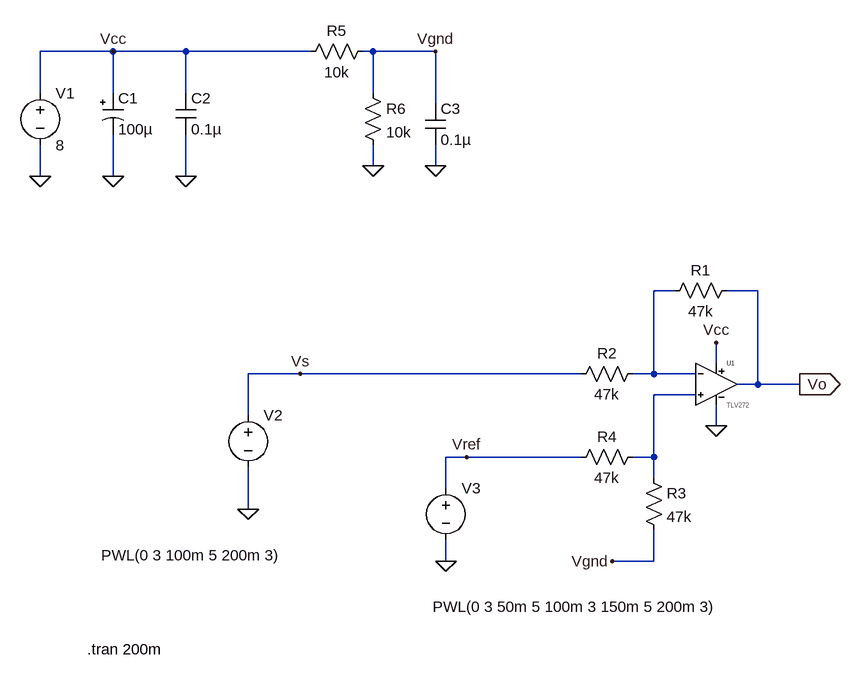
[diagram p0: schematic Virtual_Ground_Test_Circuit.asc]
Virtual_Ground_Test_Circuit.asc, the LTspice schematic file:
Version 4
SHEET 1 1016 728
WIRE -128 -208 -240 -208
WIRE -16 -208 -128 -208
WIRE 176 -208 -16 -208
WIRE 272 -208 256 -208
WIRE 368 -208 272 -208
WIRE -240 -144 -240 -208
WIRE -128 -144 -128 -208
WIRE -16 -144 -16 -208
WIRE 272 -144 272 -208
WIRE 368 -128 368 -208
WIRE 272 -32 272 -64
WIRE 368 -32 368 -64
WIRE -240 -16 -240 -64
WIRE -128 -16 -128 -80
WIRE -16 -16 -16 -80
WIRE 736 160 704 160
WIRE 864 160 816 160
WIRE 800 272 800 240
WIRE 160 288 80 288
WIRE 592 288 160 288
WIRE 704 288 704 160
WIRE 704 288 672 288
WIRE 768 288 704 288
WIRE 864 304 864 160
WIRE 864 304 832 304
WIRE 928 304 864 304
WIRE 768 320 704 320
WIRE 80 352 80 288
WIRE 800 368 800 336
WIRE 416 416 384 416
WIRE 592 416 416 416
WIRE 704 416 704 320
WIRE 704 416 672 416
WIRE 704 448 704 416
WIRE 384 464 384 416
WIRE 80 496 80 432
WIRE 384 576 384 544
WIRE 704 576 704 528
WIRE 704 576 640 576
FLAG -240 -16 0
FLAG -128 -16 0
FLAG -16 -16 0
FLAG 80 496 0
FLAG 800 240 Vcc
FLAG 800 368 0
FLAG 384 576 0
FLAG 928 304 Vo
IOPIN 928 304 Out
FLAG 416 416 Vref
FLAG 160 288 Vs
FLAG 272 -32 0
FLAG 368 -32 0
FLAG -128 -208 Vcc
FLAG 368 -208 Vgnd
FLAG 640 576 Vgnd
SYMBOL voltage -240 -160 R0
SYMATTR InstName V1
SYMATTR Value 8
SYMBOL polcap -144 -144 R0
SYMATTR InstName C1
SYMATTR Value 100µ
SYMBOL cap -32 -144 R0
SYMATTR InstName C2
SYMATTR Value 0.1µ
SYMBOL voltage 80 336 R0
WINDOW 3 -226 231 Left 2
WINDOW 123 0 0 Left 0
WINDOW 39 0 0 Left 0
SYMATTR Value PWL(0 3 100m 5 200m 3)
SYMATTR InstName V2
SYMBOL res 688 272 R90
WINDOW 0 0 56 VBottom 2
WINDOW 3 32 56 VTop 2
SYMATTR InstName R2
SYMATTR Value 47k
SYMBOL TLV272 800 304 R0
SYMATTR InstName U1
SYMBOL res 832 144 R90
WINDOW 0 0 56 VBottom 2
WINDOW 3 32 56 VTop 2
SYMATTR InstName R1
SYMATTR Value 47k
SYMBOL res 688 400 R90
WINDOW 0 0 56 VBottom 2
WINDOW 3 32 56 VTop 2
SYMATTR InstName R4
SYMATTR Value 47k
SYMBOL res 688 432 R0
SYMATTR InstName R3
SYMATTR Value 47k
SYMBOL voltage 384 448 R0
WINDOW 3 -20 198 Left 2
WINDOW 123 0 0 Left 0
WINDOW 39 0 0 Left 0
SYMATTR Value PWL(0 3 50m 5 100m 3 150m 5 200m 3)
SYMATTR InstName V3
SYMBOL res 272 -224 R90
WINDOW 0 0 56 VBottom 2
WINDOW 3 32 56 VTop 2
SYMATTR InstName R5
SYMATTR Value 10k
SYMBOL res 256 -160 R0
SYMATTR InstName R6
SYMATTR Value 10k
SYMBOL cap 352 -128 R0
SYMATTR InstName C3
SYMATTR Value 0.1µ
TEXT -168 712 Left 2 !.tran 200m

The netlist it stands for:
* Virtual_Ground_Test_Circuit.asc
V1 Vcc 0 8
C1 Vcc 0 100µ
C2 Vcc 0 0.1µ
V2 Vs 0 PWL(0 3 100m 5 200m 3)
R2 N001 Vs 47k
XU1 N002 N001 Vcc 0 Vo level.2 Avol=1Meg GBW=3Meg Slew=2.4Meg ilimit=20m rail=0.1 Vos=0 phimargin=45 en=0 enk=0 in=0 ink=0 Rin=500Meg  ; pins In+ In- V+ V- OUT
R1 Vo N001 47k
R4 N002 Vref 47k
R3 N002 Vgnd 47k
V3 Vref 0 PWL(0 3 50m 5 100m 3 150m 5 200m 3)
R5 Vgnd Vcc 10k
R6 Vgnd 0 10k
C3 Vgnd 0 0.1µ
.tran 200m
.lib UniversalOpamps2.sub
.backanno
.end